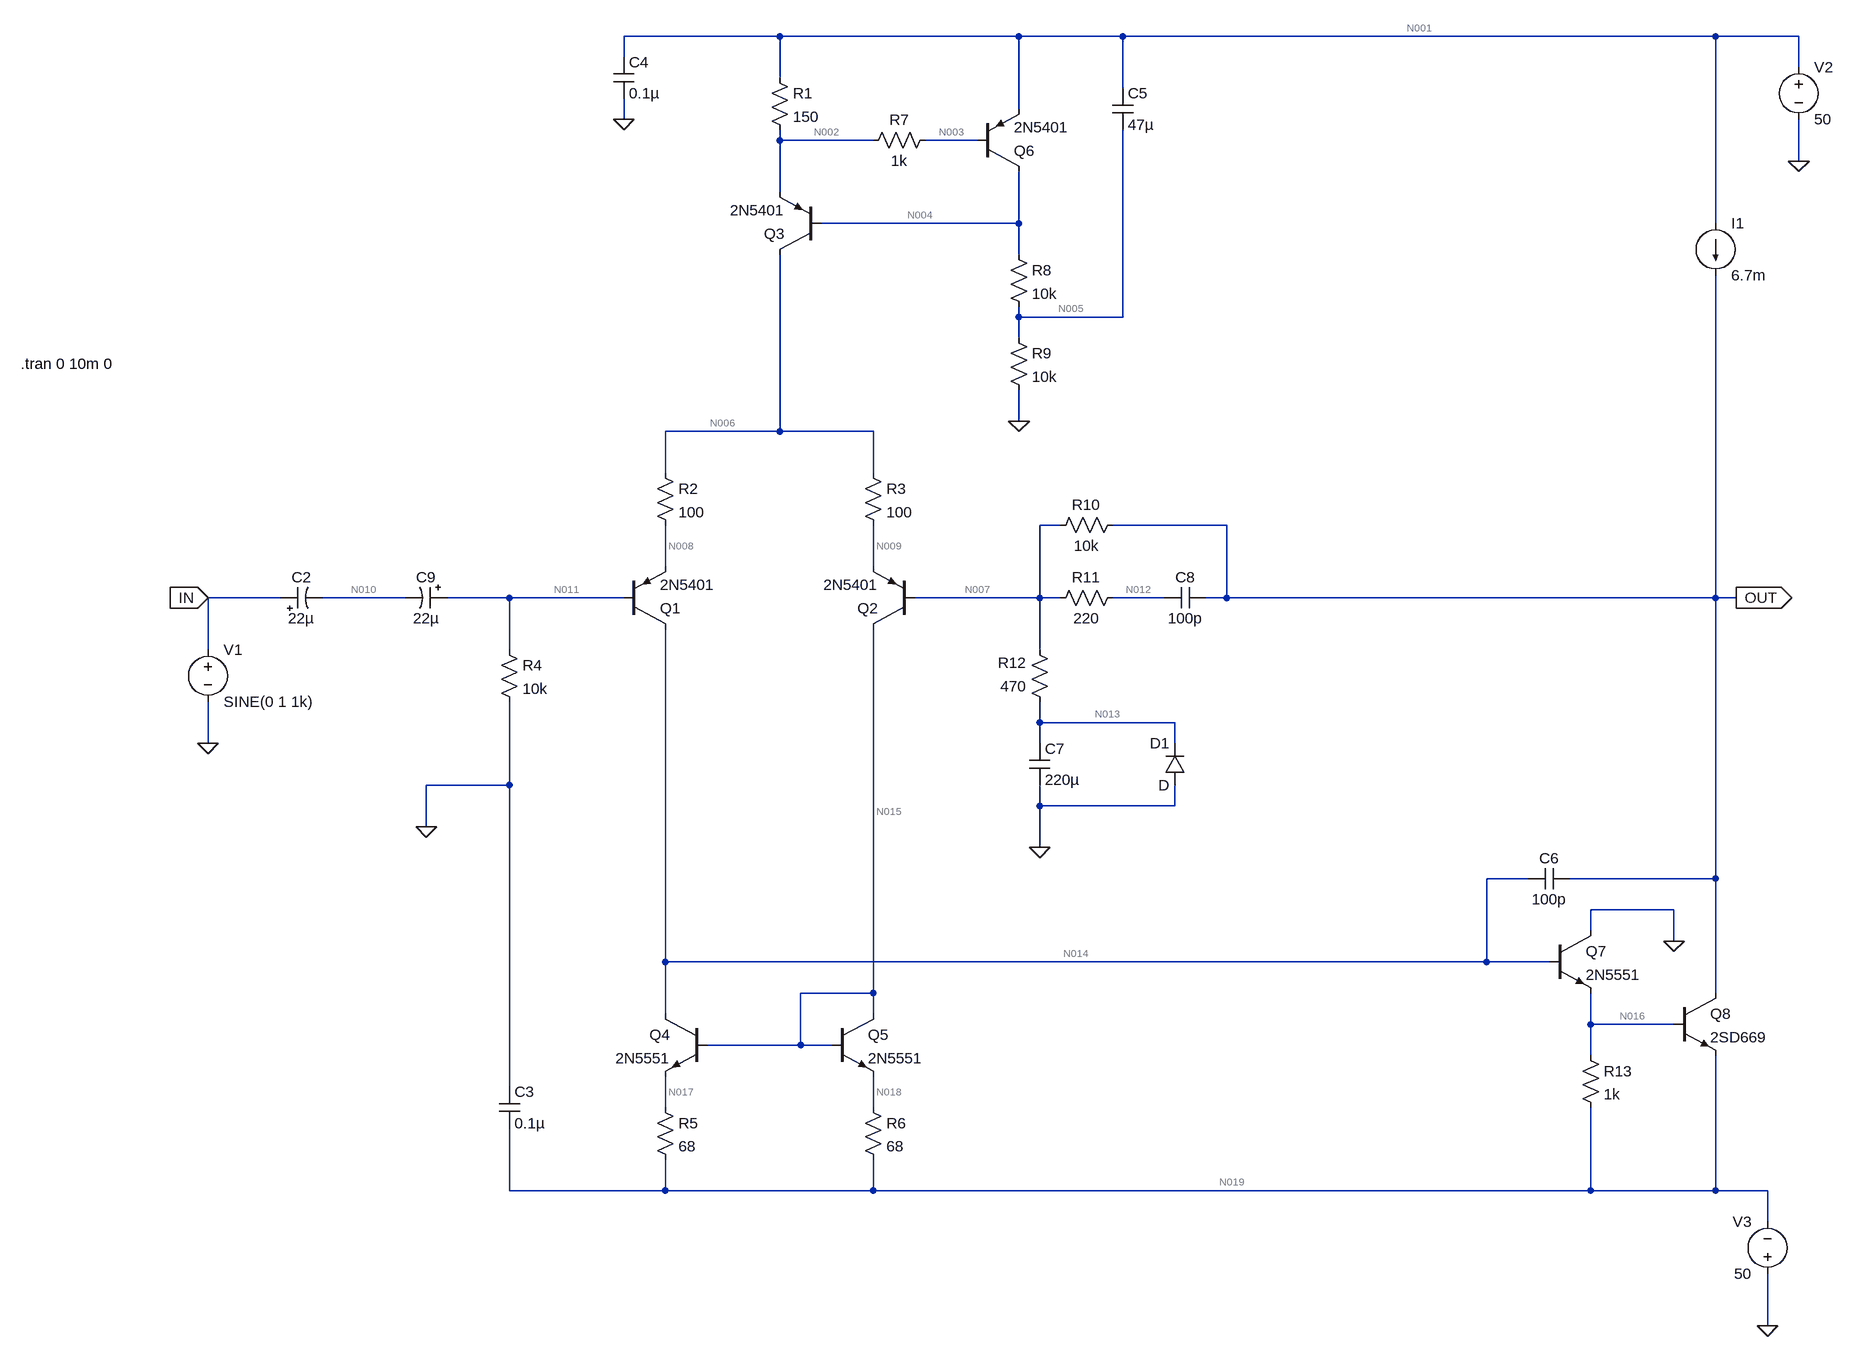
[diagram p0: schematic InputStage.asc]
InputStage.asc, the LTspice schematic file:
Version 4.1
SHEET 1 3884 1172
WIRE 576 -832 336 -832
WIRE 944 -832 576 -832
WIRE 1104 -832 944 -832
WIRE 2016 -832 1104 -832
WIRE 2144 -832 2016 -832
WIRE 336 -800 336 -832
WIRE 2144 -784 2144 -832
WIRE 576 -768 576 -832
WIRE 1104 -752 1104 -832
WIRE 944 -720 944 -832
WIRE 336 -704 336 -736
WIRE 576 -672 576 -688
WIRE 720 -672 576 -672
WIRE 880 -672 800 -672
WIRE 2144 -640 2144 -704
WIRE 576 -592 576 -672
WIRE 944 -544 944 -624
WIRE 944 -544 640 -544
WIRE 2016 -544 2016 -832
WIRE 944 -496 944 -544
WIRE 944 -400 944 -416
WIRE 1104 -400 1104 -688
WIRE 1104 -400 944 -400
WIRE 944 -368 944 -400
WIRE 944 -240 944 -288
WIRE 576 -224 576 -496
WIRE 576 -224 400 -224
WIRE 720 -224 576 -224
WIRE 400 -160 400 -224
WIRE 720 -160 720 -224
WIRE 1008 -80 976 -80
WIRE 1264 -80 1088 -80
WIRE 400 -16 400 -80
WIRE 720 -16 720 -80
WIRE -192 32 -304 32
WIRE 0 32 -128 32
WIRE 160 32 64 32
WIRE 336 32 160 32
WIRE 976 32 976 -80
WIRE 976 32 784 32
WIRE 1008 32 976 32
WIRE 1168 32 1088 32
WIRE 1264 32 1264 -80
WIRE 1264 32 1232 32
WIRE 2016 32 2016 -464
WIRE 2016 32 1264 32
WIRE 2048 32 2016 32
WIRE -304 112 -304 32
WIRE 160 112 160 32
WIRE 976 112 976 32
WIRE 976 224 976 192
WIRE 1184 224 976 224
WIRE -304 256 -304 192
WIRE 976 256 976 224
WIRE 1184 256 1184 224
WIRE 160 320 160 192
WIRE 160 320 32 320
WIRE 976 352 976 320
WIRE 1184 352 1184 320
WIRE 1184 352 976 352
WIRE 32 384 32 320
WIRE 976 416 976 352
WIRE 1728 464 1664 464
WIRE 2016 464 2016 32
WIRE 2016 464 1792 464
WIRE 1952 512 1824 512
WIRE 1824 544 1824 512
WIRE 1952 560 1952 512
WIRE 400 592 400 80
WIRE 1664 592 1664 464
WIRE 1664 592 400 592
WIRE 1760 592 1664 592
WIRE 720 640 720 80
WIRE 720 640 608 640
WIRE 2016 640 2016 464
WIRE 400 672 400 592
WIRE 720 672 720 640
WIRE 1824 688 1824 640
WIRE 1952 688 1824 688
WIRE 608 720 608 640
WIRE 608 720 464 720
WIRE 656 720 608 720
WIRE 1824 736 1824 688
WIRE 160 784 160 320
WIRE 400 816 400 768
WIRE 720 816 720 768
WIRE 160 944 160 848
WIRE 400 944 400 896
WIRE 400 944 160 944
WIRE 720 944 720 896
WIRE 720 944 400 944
WIRE 1824 944 1824 816
WIRE 1824 944 720 944
WIRE 2016 944 2016 736
WIRE 2016 944 1824 944
WIRE 2096 944 2016 944
WIRE 2096 992 2096 944
WIRE 2096 1152 2096 1072
FLAG -304 256 0
FLAG 32 384 0
FLAG 944 -240 0
FLAG 336 -704 0
FLAG 976 416 0
FLAG 1952 560 0
FLAG 2048 32 OUT
IOPIN 2048 32 Out
FLAG 2144 -640 0
FLAG 2096 1152 0
FLAG -304 32 IN
IOPIN -304 32 In
SYMBOL voltage -304 96 R0
WINDOW 123 0 0 Left 0
WINDOW 39 0 0 Left 0
SYMATTR InstName V1
SYMATTR Value SINE(0 1 1k)
SYMBOL res 144 96 R0
SYMATTR InstName R4
SYMATTR Value 10k
SYMBOL cap 144 784 R0
SYMATTR InstName C3
SYMATTR Value 0.1µ
SYMATTR SpiceLine V=16 Irms=3.85 Rser=0.0464862 Lser=0 mfg="KEMET" pn="C0402C104K4PAC" type="X5R"
SYMBOL res 384 800 R0
SYMATTR InstName R5
SYMATTR Value 68
SYMBOL res 704 800 R0
SYMATTR InstName R6
SYMATTR Value 68
SYMBOL npn 464 672 M0
SYMATTR InstName Q4
SYMATTR Value 2N5551
SYMBOL pnp 336 80 M180
SYMATTR InstName Q1
SYMATTR Value 2N5401
SYMBOL npn 656 672 R0
SYMATTR InstName Q5
SYMATTR Value 2N5551
SYMBOL pnp 784 80 R180
SYMATTR InstName Q2
SYMATTR Value 2N5401
SYMBOL res 384 -176 R0
SYMATTR InstName R2
SYMATTR Value 100
SYMBOL res 704 -176 R0
SYMATTR InstName R3
SYMATTR Value 100
SYMBOL pnp 640 -496 R180
SYMATTR InstName Q3
SYMATTR Value 2N5401
SYMBOL res 928 -512 R0
SYMATTR InstName R8
SYMATTR Value 10k
SYMBOL res 928 -384 R0
SYMATTR InstName R9
SYMATTR Value 10k
SYMBOL pnp 880 -624 M180
SYMATTR InstName Q6
SYMATTR Value 2N5401
SYMBOL res 560 -784 R0
SYMATTR InstName R1
SYMATTR Value 150
SYMBOL res 816 -688 R90
WINDOW 0 0 56 VBottom 2
WINDOW 3 32 56 VTop 2
SYMATTR InstName R7
SYMATTR Value 1k
SYMBOL cap 1088 -752 R0
SYMATTR Value 47µ
SYMATTR InstName C5
SYMATTR SpiceLine V=4 Irms=0 Rser=2.4 Lser=0 mfg="AVX" pn="TAJB476M004" type="Tantalum"
SYMBOL cap 320 -800 R0
SYMATTR InstName C4
SYMATTR Value 0.1µ
SYMATTR SpiceLine V=16 Irms=3.85 Rser=0.0464862 Lser=0 mfg="KEMET" pn="C0402C104K4PAC" type="X5R"
SYMBOL res 1104 16 R90
WINDOW 0 0 56 VBottom 2
WINDOW 3 32 56 VTop 2
SYMATTR InstName R11
SYMATTR Value 220
SYMBOL res 1104 -96 R90
WINDOW 0 0 56 VBottom 2
WINDOW 3 32 56 VTop 2
SYMATTR InstName R10
SYMATTR Value 10k
SYMBOL res 992 208 R180
WINDOW 0 36 76 Left 2
WINDOW 3 36 40 Left 2
SYMATTR InstName R12
SYMATTR Value 470
SYMBOL cap 1232 16 R90
WINDOW 0 0 32 VBottom 2
WINDOW 3 32 32 VTop 2
SYMATTR InstName C8
SYMATTR Value 100p
SYMBOL cap 960 256 R0
SYMATTR InstName C7
SYMATTR Value 220µ
SYMATTR SpiceLine V=10 Irms=0 Rser=0.9 Lser=0 mfg="AVX" pn="TAJE227K010" type="Tantalum"
SYMBOL diode 1200 320 R180
WINDOW 0 24 64 Left 2
WINDOW 3 24 0 Left 2
SYMATTR InstName D1
SYMBOL cap 1792 448 R90
WINDOW 0 0 32 VBottom 2
WINDOW 3 32 32 VTop 2
SYMATTR InstName C6
SYMATTR Value 100p
SYMBOL npn 1760 544 R0
SYMATTR InstName Q7
SYMATTR Value 2N5551
SYMBOL npn 1952 640 R0
SYMATTR InstName Q8
SYMATTR Value 2SD669
SYMBOL res 1808 720 R0
SYMATTR InstName R13
SYMATTR Value 1k
SYMBOL voltage 2144 -800 R0
SYMATTR InstName V2
SYMATTR Value 50
SYMBOL voltage 2096 1088 R180
WINDOW 0 24 96 Left 2
WINDOW 3 24 16 Left 2
SYMATTR InstName V3
SYMATTR Value 50
SYMBOL current 2016 -544 R0
SYMATTR InstName I1
SYMATTR Value 6.7m
SYMBOL polcap -192 48 R270
WINDOW 0 32 32 VTop 2
WINDOW 3 0 32 VBottom 2
SYMATTR InstName C2
SYMATTR Value 22µ
SYMBOL polcap 64 16 R90
WINDOW 0 0 32 VBottom 2
WINDOW 3 32 32 VTop 2
SYMATTR InstName C9
SYMATTR Value 22µ
TEXT -592 -328 Left 2 !.tran 0 10m 0

The netlist it stands for:
* InputStage.asc
V1 IN 0 SINE(0 1 1k)
R4 N011 0 10k
C3 0 N019 0.1µ V=16 Irms=3.85 Rser=0.0464862 Lser=0 mfg="KEMET" pn="C0402C104K4PAC" type="X5R"
R5 N017 N019 68
R6 N018 N019 68
Q4 N014 N015 N017 0 2N5551
Q1 N014 N011 N008 0 2N5401
Q5 N015 N015 N018 0 2N5551
Q2 N015 N007 N009 0 2N5401
R2 N006 N008 100
R3 N006 N009 100
Q3 N006 N004 N002 0 2N5401
R8 N004 N005 10k
R9 N005 0 10k
Q6 N004 N003 N001 0 2N5401
R1 N001 N002 150
R7 N003 N002 1k
C5 N001 N005 47µ V=4 Irms=0 Rser=2.4 Lser=0 mfg="AVX" pn="TAJB476M004" type="Tantalum"
C4 N001 0 0.1µ V=16 Irms=3.85 Rser=0.0464862 Lser=0 mfg="KEMET" pn="C0402C104K4PAC" type="X5R"
R11 N012 N007 220
R10 OUT N007 10k
R12 N013 N007 470
C8 OUT N012 100p
C7 N013 0 220µ V=10 Irms=0 Rser=0.9 Lser=0 mfg="AVX" pn="TAJE227K010" type="Tantalum"
D1 0 N013 D
C6 OUT N014 100p
Q7 0 N014 N016 0 2N5551
Q8 OUT N016 N019 0 2SD669
R13 N016 N019 1k
V2 N001 0 50
V3 0 N019 50
I1 N001 OUT 6.7m
C2 IN N010 22µ
C9 N011 N010 22µ
.model D D
.lib standard.dio
.model NPN NPN
.model PNP PNP
.lib standard.bjt
.tran 0 10m 0
.backanno
.end

* Results of the author's LTspice run, read from the files saved beside the schematic
* Operating Point, zero values left out:
*   V(n001) = 50 V
*   V(n002) = 49.32 V
*   V(n003) = 49.34 V
*   V(n004) = 48.66 V
*   V(n005) = 24.33 V
*   V(n006) = 979.7 mV
*   V(n007) = 91.14 mV
*   V(n008) = 768.2 mV
*   V(n009) = 739.1 mV
*   V(n010) = 2.72 µV
*   V(n011) = 123.6 mV
*   V(n012) = 91.14 mV
*   V(n013) = 91.14 mV
*   V(n014) = -48.78 V
*   V(n015) = -49.12 V
*   V(n016) = -49.46 V
*   V(n017) = -49.85 V
*   V(n018) = -49.85 V
*   V(n019) = -50 V
*   V(out) = -48.77 mV
*   I(I1) = 6.7 mA
*   I(R1) = 4.527 mA
*   I(R10) = -13.99 µA
*   I(R13) = 538 µA
*   I(R2) = 2.115 mA
*   I(R3) = 2.407 mA
*   I(R4) = 12.36 µA
*   I(R5) = 2.222 mA
*   I(R6) = 2.221 mA
*   I(R7) = 20.67 µA
*   I(R8) = 2.433 mA
*   I(R9) = 2.433 mA
*   I(V2) = -13.65 mA
*   I(V3) = -11.72 mA
*   Ib(Q1) = -12.36 µA
*   Ib(Q2) = -13.99 µA
*   Ib(Q3) = -26.38 µA
*   Ib(Q4) = 171.4 µA
*   Ib(Q5) = 171.7 µA
*   Ib(Q6) = -20.67 µA
*   Ib(Q7) = 52 µA
*   Ib(Q8) = 25.27 µA
*   Ic(Q1) = -2.103 mA
*   Ic(Q2) = -2.393 mA
*   Ic(Q3) = -4.522 mA
*   Ic(Q4) = 2.051 mA
*   Ic(Q5) = 2.049 mA
*   Ic(Q6) = -2.406 mA
*   Ic(Q7) = 511.3 µA
*   Ic(Q8) = 6.714 mA
*   Ie(Q1) = 2.115 mA
*   Ie(Q2) = 2.407 mA
*   Ie(Q3) = 4.548 mA
*   Ie(Q4) = -2.222 mA
*   Ie(Q5) = -2.221 mA
*   Ie(Q6) = 2.427 mA
*   Ie(Q7) = -563.3 µA
*   Ie(Q8) = -6.739 mA
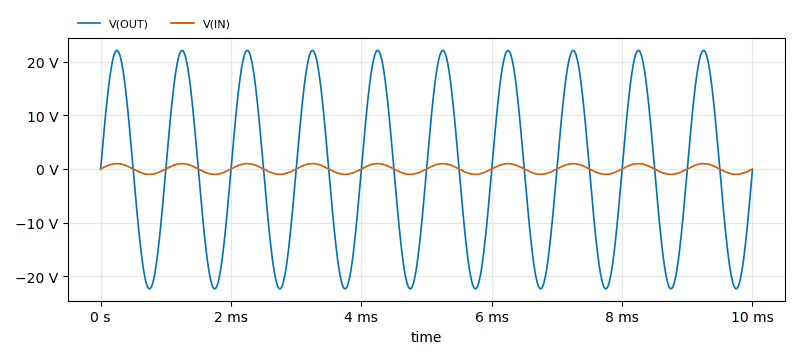
[diagram p1: Transient Analysis of InputStage.asc, plotted from the saved traces]
* Transient Analysis, 1 run:
*   V(OUT): min -22.34 V, max 22.13 V, average -109.2 mV, rms 15.72 V, last -211.2 mV
*   V(IN): min -1 V, max 1 V, average 0 V, rms 707.1 mV, last 0 V